# EAGLE design v1 (EAGLE 8.4.3)
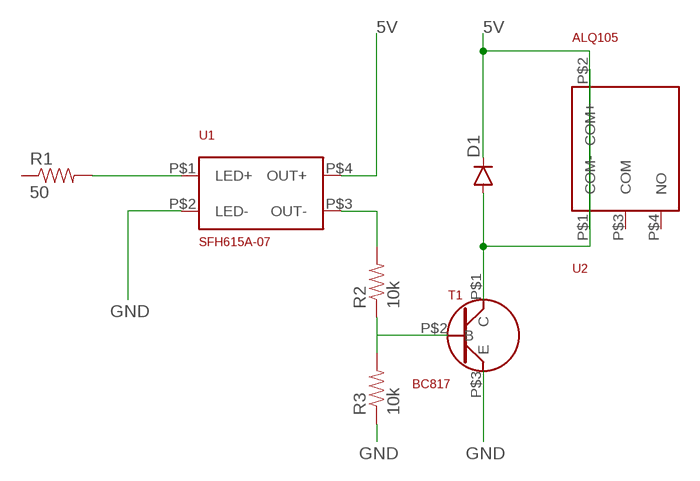
[diagram p0: schematic, sheet 1]

## Parts
D1  DIODESMA  [SMA-DIODE]
R1  50  RESISTOR0603-RES  [0603-RES]
R2  10k  RESISTOR0603-RES  [0603-RES]
R3  10k  RESISTOR0603-RES  [0603-RES]
T1  BC817  [BC817]
U1  SFH615A-07  [SFH615A-07]
U2  ALQ105  [ALQ105]

## Nets
5V: D1.C U1.P$4(OUT+) U2.P$1(COM-)
GND: R3.1 T1.P$3(E) U1.P$2(LED-)
N$1: R1.2 U1.P$1(LED+)
N$2: R2.2 U1.P$3(OUT-)
N$3: R2.1 R3.2 T1.P$2(B)
N$4: D1.A T1.P$1(C) U2.P$2(COM+)
Unconnected: R1.1 U2.P$3(COM) U2.P$4(NO)

## Library data of the parts
D1 = SparkFun-DiscreteSemi:DIODE: Diode These are standard reverse protection diodes and small signal diodes. SMA package can handle up to about 1A. SOD-323 can handle about 200mA. What the SOD-323 package when ordering, there are some mfgs out there that are 5-pin packages.
R1-R3 = SparkFun-Passives:RESISTOR: Resistor Basic schematic elements and footprints for 0603, 1206, and PTH resistors.
T1 = lib:BC817: NPN Transistor BC817 Data sheet <https://www.diodes.com/assets/Datasheets/ds30575.pdf>
U1 = lib:SFH615A-07: Vishay Optocoupler SFH615A-007 Data sheet <http://www.vishay.com/docs/83433/sfh615a.pdf>
U2 = lib:ALQ105: ALQ105 Solenoid Data sheet <http://www3.panasonic.biz/ac/e_download/control/relay/power/catalog/mech_eng_lq.pdf>

## Board
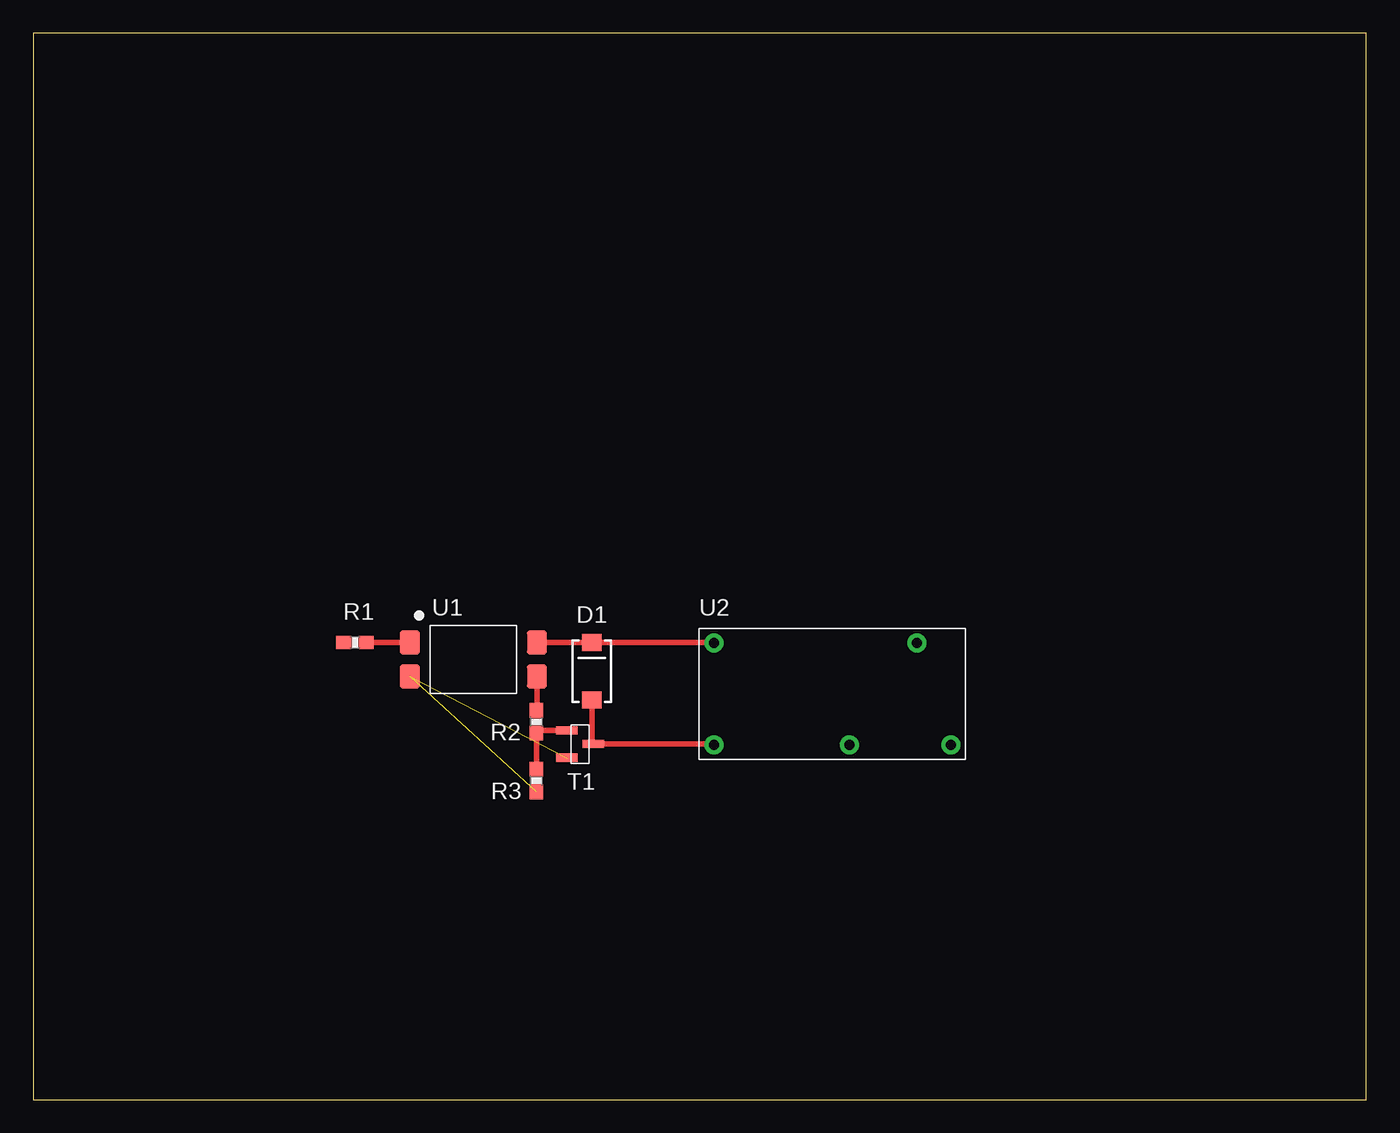
[diagram p1: board, top side]

Size 100 x 80 mm. Coordinates in mm from the lower left corner, seen from the top.
Outline: 0,0 100,0 100,80 0,80 0,0
Copper layers (1*16): Top 0.035mm / dielectric 1.5mm / Bottom 0.035mm
Design rules "default": minimum track width 6mil, minimum drill 0.35mm, track to track 6mil, track to pad 6mil, pad to pad 6mil, via to via 6mil, smd to smd 6mil, copper to edge 40mil, drill to drill 6mil, minimum pad ring 10mil, minimum via ring 8mil, stop-mask expansion 4mil, vias tented up to drill 0mil, thermal gap 10mil

### Footprints (pad centres in the part's own frame; a part is rotated, then mirrored left to right if it is on the bottom)
SMA-DIODE = smd 1.27 x 1.47: A -2.15,0; C 2.15,0
0603-RES = smd 1.1 x 1: 1 -0.85,0; 2 0.85,0
BC817 = smd 0.612 x 1.626: P$1 0,0.996; P$2 -1.025,-0.996; P$3 1.025,-0.996
SFH615A-07 = smd 1.52 x 1.78: P$1 -4.765,1.27; P$2 -4.765,-1.27; P$3 4.765,-1.27; P$4 4.765,1.27
ALQ105 = drill 0.75 pad 1.422: P$1 -8.89,3.81; P$2 -8.89,-3.81; P$3 1.27,-3.81; P$4 8.89,-3.81; P$5 6.35,3.81

### Placement (x,y rotation side)
D1  41.91,32.13 90 top
R1  24.13,34.29 0 top
R2  37.74,28.35 90 top
R3  37.74,23.93 90 top
T1  41.02,26.67 270 top
U1  33.02,33.02 0 top
U2  59.94,30.43 0 top

### Tracks (layer width: path | path; a pad name or v marks a point on that pad's centre or on a via)
5V
  Top 0.406: U1.P$4 D1.C 51.01,34.28 U2.P$1
GND  (2 unrouted)
N$1
  Top 0.406: R1.2 U1.P$1
N$2
  Top 0.406: U1.P$3 37.78,29.09 R2.2
N$3
  Top 0.406: 37.74,27.68 T1.P$2 | 37.74,27.68 37.77,27.32 R2.1 | 37.74,27.68 R3.2
N$4
  Top 0.406: D1.A 41.91,26.73 T1.P$1 51,26.67 U2.P$2